# EAGLE schematic power_supply_v1 (EAGLE 6.4)

## Sheet 1 of 4: Power
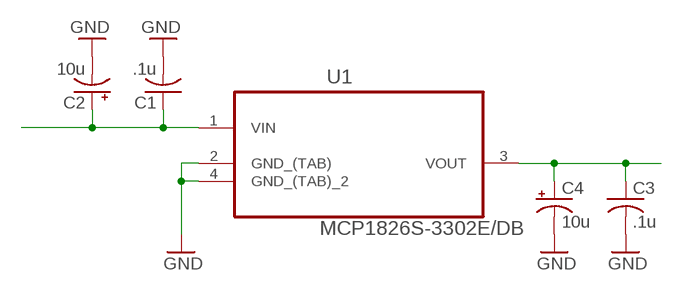
[diagram p0: schematic, sheet 1]

### Parts
C1  .1u  C-USC0603  [C0603]
C2  10u  CPOL-USD/7343-31W  [D/7343-31W]
C3  .1u  C-USC0603  [C0603]
C4  10u  CPOL-USD/7343-31W  [D/7343-31W]
U1  MCP1826S-3302E/DB  [SOT230P700X180-4N]

### Nets
3V3: C3.1 C4.+ U1.3(VOUT)
GND: C1.2 C2.- C3.2 C4.- U1.2(GND_(TAB)) U1.4(GND_(TAB)_2)
N$5: C1.1 C2.+ U1.1(VIN)

## Sheet 2 of 4: MCU
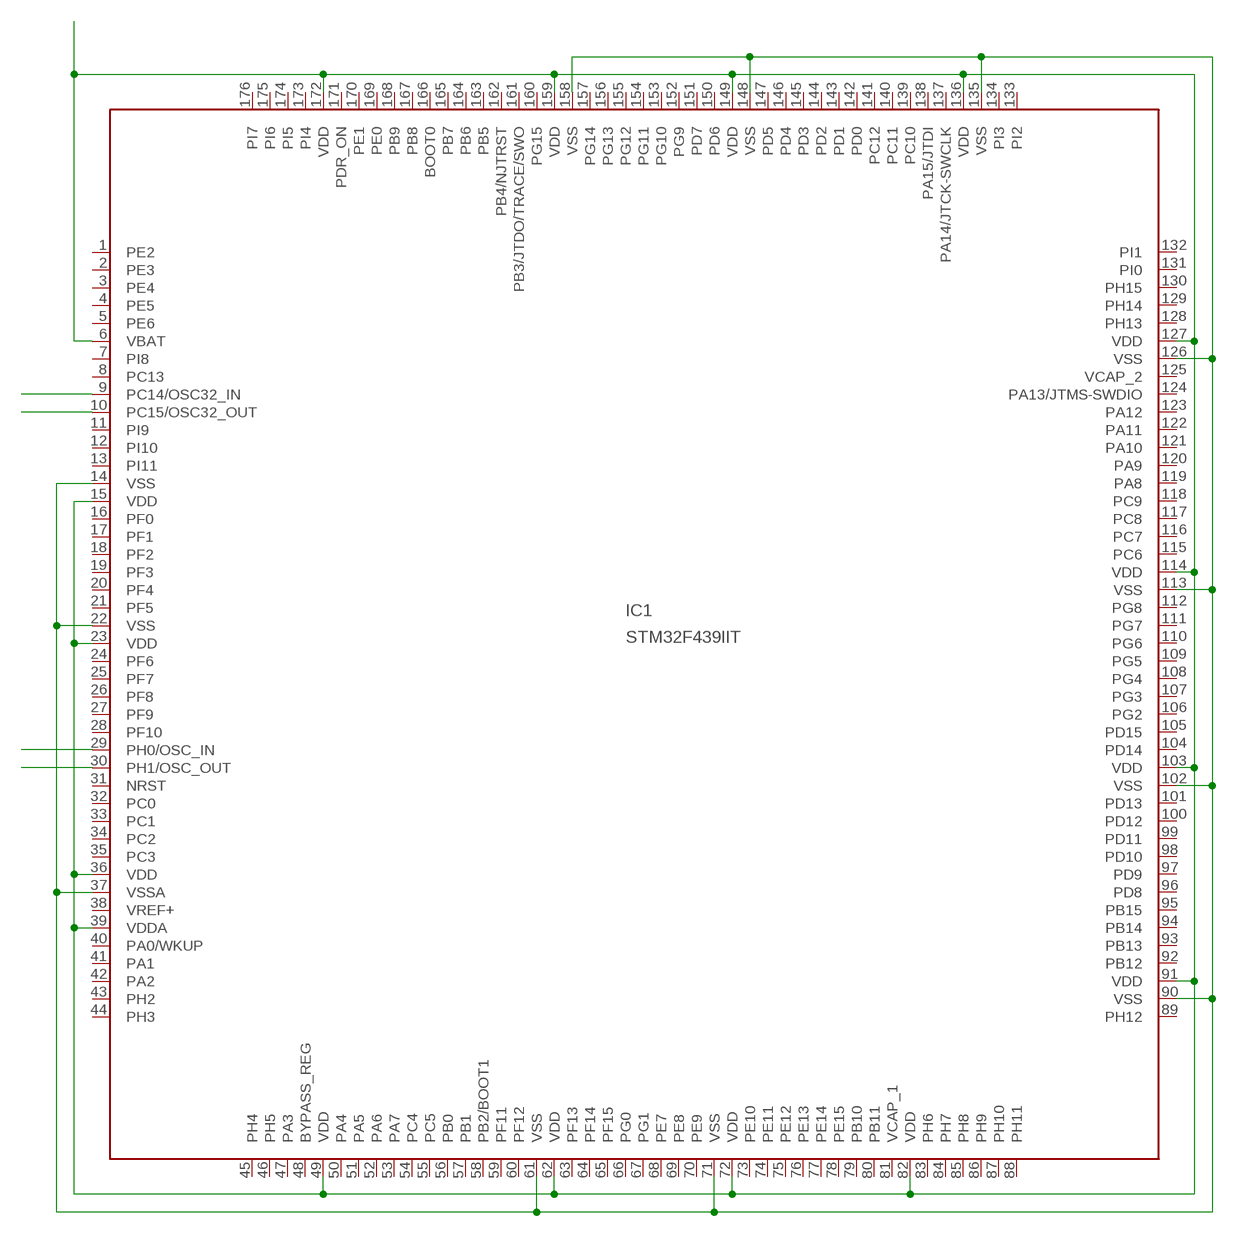
[diagram p1: schematic, sheet 2]

### Parts
IC1  STM32F439IIT  [LQFP-176]

### Nets
N$1: IC1.9(PC14/OSC32_IN)
N$2: IC1.10(PC15/OSC32_OUT)
N$3: IC1.29(PH0/OSC_IN)
N$4: IC1.30(PH1/OSC_OUT)
N$6: IC1.6(VBAT) IC1.15(VDD) IC1.23(VDD) IC1.36(VDD) IC1.39(VDDA) IC1.49(VDD) IC1.62(VDD) IC1.72(VDD) IC1.82(VDD) IC1.91(VDD) IC1.103(VDD) IC1.114(VDD) IC1.127(VDD) IC1.136(VDD) IC1.149(VDD) IC1.159(VDD) IC1.172(VDD)
N$7: IC1.14(VSS) IC1.22(VSS) IC1.37(VSSA) IC1.61(VSS) IC1.71(VSS) IC1.90(VSS) IC1.102(VSS) IC1.113(VSS) IC1.126(VSS) IC1.135(VSS) IC1.148(VSS) IC1.158(VSS)
Unconnected: IC1.1(PE2) IC1.2(PE3) IC1.3(PE4) IC1.4(PE5) IC1.5(PE6) IC1.7(PI8) IC1.8(PC13) IC1.11(PI9) IC1.12(PI10) IC1.13(PI11) IC1.16(PF0) IC1.17(PF1) IC1.18(PF2) IC1.19(PF3) IC1.20(PF4) IC1.21(PF5) IC1.24(PF6) IC1.25(PF7) IC1.26(PF8) IC1.27(PF9) IC1.28(PF10) IC1.31(NRST) IC1.32(PC0) IC1.33(PC1) IC1.34(PC2) IC1.35(PC3) IC1.40(PA0/WKUP) IC1.41(PA1) IC1.42(PA2) IC1.43(PH2) IC1.44(PH3) IC1.45(PH4) IC1.46(PH5) IC1.47(PA3) IC1.48(BYPASS_REG) IC1.50(PA4) IC1.51(PA5) IC1.52(PA6) IC1.53(PA7) IC1.54(PC4) IC1.55(PC5) IC1.56(PB0) IC1.57(PB1) IC1.58(PB2/BOOT1) IC1.59(PF11) IC1.60(PF12) IC1.63(PF13) IC1.64(PF14) IC1.65(PF15) IC1.66(PG0) IC1.67(PG1) IC1.68(PE7) IC1.69(PE8) IC1.70(PE9) IC1.73(PE10) IC1.74(PE11) IC1.75(PE12) IC1.76(PE13) IC1.77(PE14) IC1.78(PE15) IC1.79(PB10) IC1.80(PB11) IC1.83(PH6) IC1.84(PH7) IC1.85(PH8) IC1.86(PH9) IC1.87(PH10) IC1.88(PH11) IC1.89(PH12) IC1.92(PB12) IC1.93(PB13) IC1.94(PB14) IC1.95(PB15) IC1.96(PD8) IC1.97(PD9) IC1.98(PD10) IC1.99(PD11) IC1.100(PD12) IC1.101(PD13) IC1.104(PD14) IC1.105(PD15) IC1.106(PG2) IC1.107(PG3) IC1.108(PG4) IC1.109(PG5) IC1.110(PG6) IC1.111(PG7) IC1.112(PG8) IC1.115(PC6) IC1.116(PC7) IC1.117(PC8) IC1.118(PC9) IC1.119(PA8) IC1.120(PA9) IC1.121(PA10) IC1.122(PA11) IC1.123(PA12) IC1.124(PA13/JTMS-SWDIO) IC1.128(PH13) IC1.129(PH14) IC1.130(PH15) IC1.131(PI0) IC1.132(PI1) IC1.133(PI2) IC1.134(PI3) IC1.137(PA14/JTCK-SWCLK) IC1.138(PA15/JTDI) IC1.139(PC10) IC1.140(PC11) IC1.141(PC12) IC1.142(PD0) IC1.143(PD1) IC1.144(PD2) IC1.145(PD3) IC1.146(PD4) IC1.147(PD5) IC1.150(PD6) IC1.151(PD7) IC1.152(PG9) IC1.153(PG10) IC1.154(PG11) IC1.155(PG12) IC1.156(PG13) IC1.157(PG14) IC1.160(PG15) IC1.161(PB3/JTDO/TRACE/SWO) IC1.162(PB4/NJTRST) IC1.163(PB5) IC1.164(PB6) IC1.165(PB7) IC1.166(BOOT0) IC1.167(PB8) IC1.168(PB9) IC1.169(PE0) IC1.170(PE1) IC1.173(PI4) IC1.174(PI5) IC1.175(PI6) IC1.176(PI7)

## Sheet 3 of 4: TFT

## Sheet 4 of 4: Touch Controller

## Power pins joined to a net without a drawn wire
PDR_ON: IC1.171(PDR_ON)
VCAP_1: IC1.81(VCAP_1)
VCAP_2: IC1.125(VCAP_2)
VREF+: IC1.38(VREF+)

## Library data of the parts
C1 C3 = rcl:C-US: CAPACITOR, American symbol
C2 C4 = rcl:CPOL-US: POLARIZED CAPACITOR, American symbol
IC1 = STM32F439IIT:STM32F439IIT: edit this description Auto generated by make-symbol-device-package-bsdl.ulp Rev. 43 Source:
U1 = Microchip_By_element14_Batch_1:MCP1826S-3302E/DB: IC, LDO, 3.3V, 1A; MPN: MCP1826S-3302E/DB; OC_FARNELL: 1578424; OC_NEWARK: 27M0037; PACKAGE: SOT-223-3; SUPPLIER: Microchip